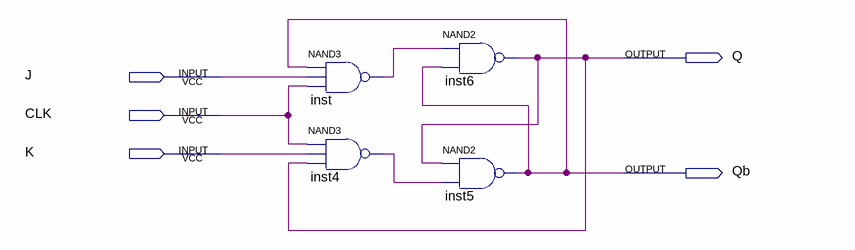
[diagram p0: schematic sheet]
// Quartus schematic blakesJKFF.bdf as structural Verilog: 4 symbols, 5 pins
module blakesJKFF (
  input  J,
  input  CLK,
  input  K,
  output Q,
  output Qb
);

  wire inst4_out, inst_out;

  nand inst (inst_out, Qb, J, CLK);
  nand inst4 (inst4_out, CLK, K, Q);
  nand inst6 (Q, inst_out, Qb);
  nand inst5 (Qb, Q, inst4_out);
endmodule
